# Altium project StepMotorDriver.PrjPcb
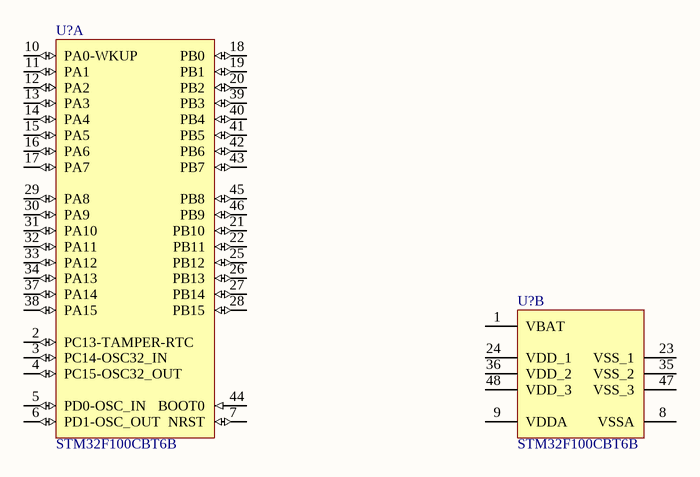
[diagram p0: MCU_Main.SchDoc]
1 sheet, 2 parts. Net scope: global (net labels, ports and power ports of the same name join across sheets).

## Sheet MCU_Main.SchDoc
size A4; SheetNumber: 1; SheetTotal: 1

### Parts
(Parts that share a designator on the sheet are numbered #1, #2 ... from top to bottom, then left to right.)
U?#1  STM32F100CBT6B  [STM-LQFP48_N]  (part A of 2)
U?#2  STM32F100CBT6B  [STM-LQFP48_N]  (part B of 2)

### Nets

Not connected (* = marked no-connect by the designer): U?#1 2(PC13-TAMPER-RTC) 3(PC14-OSC32_IN) 4(PC15-OSC32_OUT) 5(PD0-OSC_IN) 6(PD1-OSC_OUT) 7(NRST) 10(PA0-WKUP) 11(PA1) 12(PA2) 13(PA3) 14(PA4) 15(PA5) 16(PA6) 17(PA7) 18(PB0) 19(PB1) 20(PB2) 21(PB10) 22(PB11) 25(PB12) 26(PB13) 27(PB14) 28(PB15) 29(PA8) 30(PA9) 31(PA10) 32(PA11) 33(PA12) 34(PA13) 37(PA14) 38(PA15) 39(PB3) 40(PB4) 41(PB5) 42(PB6) 43(PB7) 44(BOOT0) 45(PB8) 46(PB9); U?#2 1(VBAT) 8(VSSA) 9(VDDA) 23(VSS_1) 24(VDD_1) 35(VSS_2) 36(VDD_2) 47(VSS_3) 48(VDD_3)

### Library data of the parts
U?#1 U?#2 = STM32F100CBT6B: ARM Cortex-M3 32-bit MCU, 128 KB Flash, 8 KB Internal RAM, 37 I/Os, 48-pin LQFP, -40 to 85 degC, Tray; A/D Converter: 1x12-bit (10 Channel); D/A Converter: 2x12-bit (2 Channel); FLASH Size (Prog) (kB): 128; I/Os (High Current): 37; Internal RAM Size (kB): 8; Operating Frequency(F) (Processor speed) (MHz): 24; Supply Voltage(Vcc) min (V): 2; DatasheetVersion: Rev. 7; PackageVersion: Rev. 6, 06/2013; PackageReference: LQFP48; PackageDescription: 48-Pin Low Profile Quad Flat Package, 7 x 7 mm Body, 0.5 mm Pitch; Supplier 1: Digi-Key; Supplier Part Number 1: 497-10498-ND; Supplier 2: Farnell; Supplier Part Number 2: 1838512; Supplier 3: Newark; Supplier Part Number 3: 86R1308; Supplier 4: Newark; Supplier Part Number 4: 76R0985; Supplier 5: Mouser; Supplier Part Number 5: 511-STM32F100CBT6B; Core: ARM Cortex-M3; Packing: Tray; Mounting Technology: Surface Mount; PartNumber: STM32F100CBT6B; ComponentLink1Description: Manufacturer URL; ComponentLink1URL: http://www.st.com/web/en/home.html; ComponentLink2Description: Datasheet; ComponentLink2URL: http://www.st.com/st-web-ui/static/active/en/resource/technical/document/datasheet/CD00251732.pdf; ComponentLink3Description: Package Specification; ComponentLink3URL: http://www.st.com/st-web-ui/static/active/en/resource/technical/document/datasheet/DM00058181.pdf